# Altium schematic sheet PMIC.SchDoc
size A2; SheetNumber: 5; SheetTotal: 6
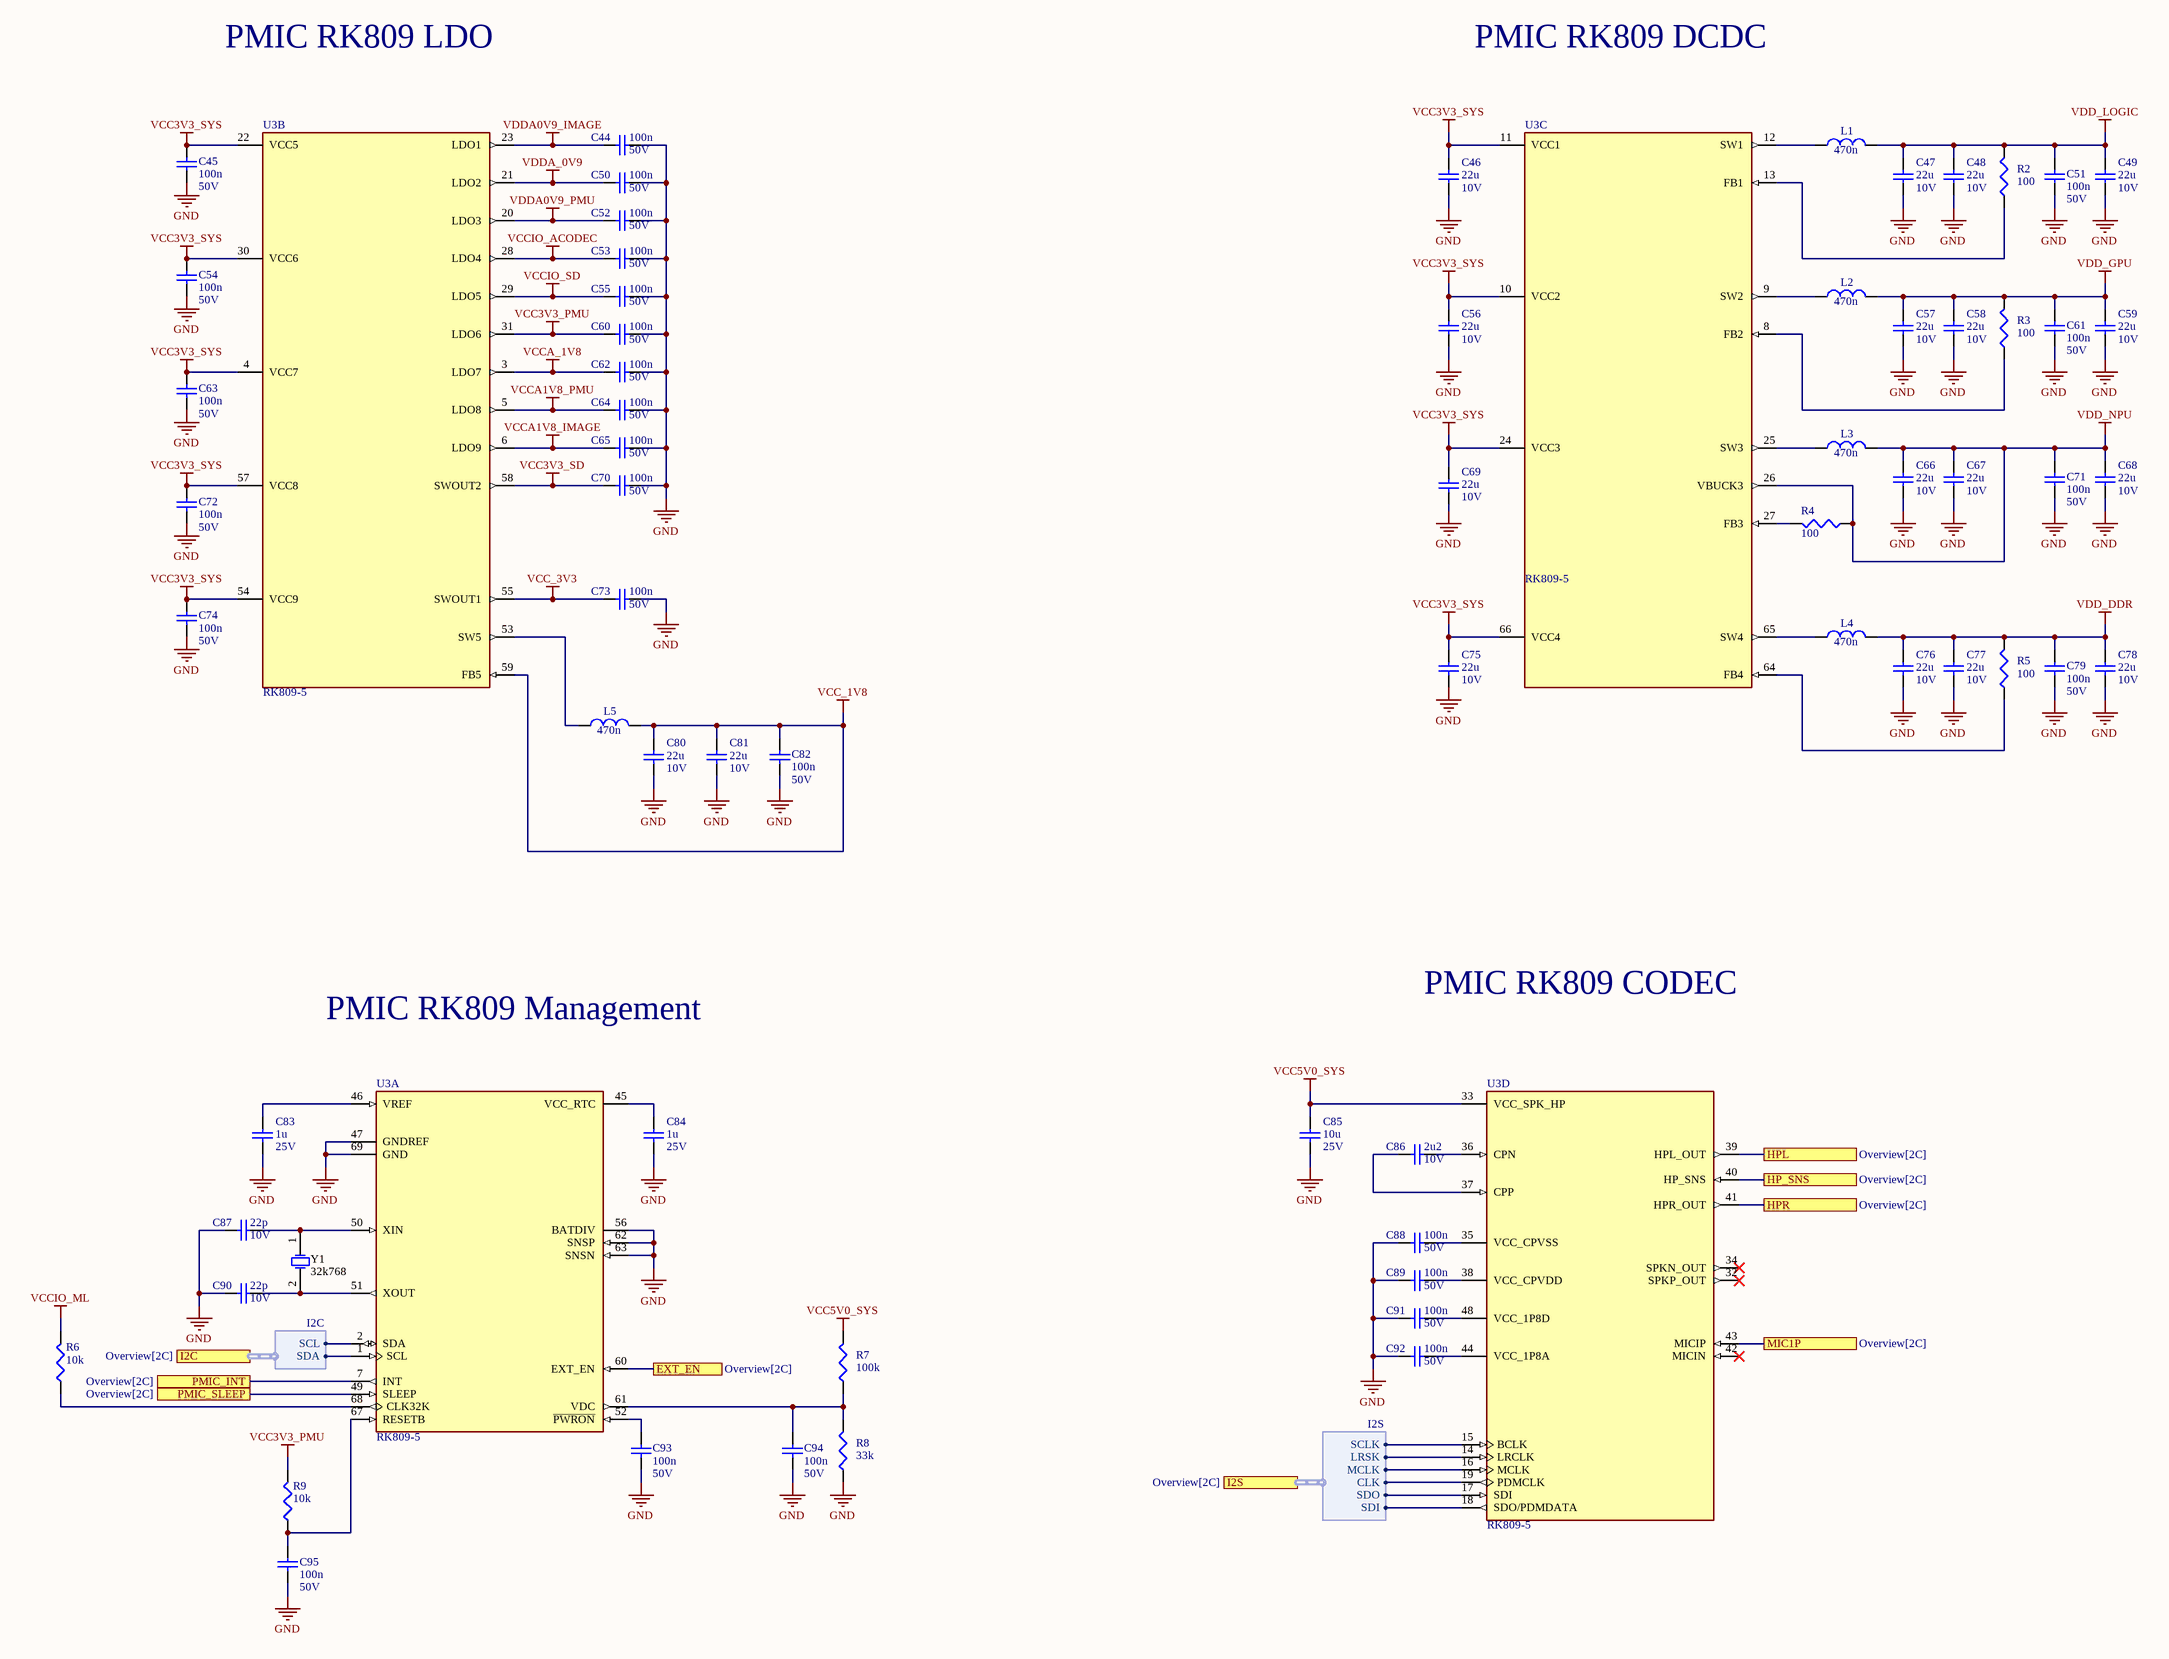
[diagram p0: PMIC.SchDoc]

## Parts
C44  value 100n  Voltage: 50V  [GRM155R71H104KE14D]  (hidden comment: GRM155R71H104KE14D)
C45  value 100n  Voltage: 50V  [GRM155R71H104KE14D]  (hidden comment: GRM155R71H104KE14D)
C46  value 22u  Voltage: 10V  [GRM188R61A226ME15D]  (hidden comment: GRM188R61A226ME15D)
C47  value 22u  Voltage: 10V  [GRM188R61A226ME15D]  (hidden comment: GRM188R61A226ME15D)
C48  value 22u  Voltage: 10V  [GRM188R61A226ME15D]  (hidden comment: GRM188R61A226ME15D)
C49  value 22u  Voltage: 10V  [GRM188R61A226ME15D]  (hidden comment: GRM188R61A226ME15D)
C50  value 100n  Voltage: 50V  [GRM155R71H104KE14D]  (hidden comment: GRM155R71H104KE14D)
C51  value 100n  Voltage: 50V  [GRM155R71H104KE14D]  (hidden comment: GRM155R71H104KE14D)
C52  value 100n  Voltage: 50V  [GRM155R71H104KE14D]  (hidden comment: GRM155R71H104KE14D)
C53  value 100n  Voltage: 50V  [GRM155R71H104KE14D]  (hidden comment: GRM155R71H104KE14D)
C54  value 100n  Voltage: 50V  [GRM155R71H104KE14D]  (hidden comment: GRM155R71H104KE14D)
C55  value 100n  Voltage: 50V  [GRM155R71H104KE14D]  (hidden comment: GRM155R71H104KE14D)
C56  value 22u  Voltage: 10V  [GRM188R61A226ME15D]  (hidden comment: GRM188R61A226ME15D)
C57  value 22u  Voltage: 10V  [GRM188R61A226ME15D]  (hidden comment: GRM188R61A226ME15D)
C58  value 22u  Voltage: 10V  [GRM188R61A226ME15D]  (hidden comment: GRM188R61A226ME15D)
C59  value 22u  Voltage: 10V  [GRM188R61A226ME15D]  (hidden comment: GRM188R61A226ME15D)
C60  value 100n  Voltage: 50V  [GRM155R71H104KE14D]  (hidden comment: GRM155R71H104KE14D)
C61  value 100n  Voltage: 50V  [GRM155R71H104KE14D]  (hidden comment: GRM155R71H104KE14D)
C62  value 100n  Voltage: 50V  [GRM155R71H104KE14D]  (hidden comment: GRM155R71H104KE14D)
C63  value 100n  Voltage: 50V  [GRM155R71H104KE14D]  (hidden comment: GRM155R71H104KE14D)
C64  value 100n  Voltage: 50V  [GRM155R71H104KE14D]  (hidden comment: GRM155R71H104KE14D)
C65  value 100n  Voltage: 50V  [GRM155R71H104KE14D]  (hidden comment: GRM155R71H104KE14D)
C66  value 22u  Voltage: 10V  [GRM188R61A226ME15D]  (hidden comment: GRM188R61A226ME15D)
C67  value 22u  Voltage: 10V  [GRM188R61A226ME15D]  (hidden comment: GRM188R61A226ME15D)
C68  value 22u  Voltage: 10V  [GRM188R61A226ME15D]  (hidden comment: GRM188R61A226ME15D)
C69  value 22u  Voltage: 10V  [GRM188R61A226ME15D]  (hidden comment: GRM188R61A226ME15D)
C70  value 100n  Voltage: 50V  [GRM155R71H104KE14D]  (hidden comment: GRM155R71H104KE14D)
C71  value 100n  Voltage: 50V  [GRM155R71H104KE14D]  (hidden comment: GRM155R71H104KE14D)
C72  value 100n  Voltage: 50V  [GRM155R71H104KE14D]  (hidden comment: GRM155R71H104KE14D)
C73  value 100n  Voltage: 50V  [GRM155R71H104KE14D]  (hidden comment: GRM155R71H104KE14D)
C74  value 100n  Voltage: 50V  [GRM155R71H104KE14D]  (hidden comment: GRM155R71H104KE14D)
C75  value 22u  Voltage: 10V  [GRM188R61A226ME15D]  (hidden comment: GRM188R61A226ME15D)
C76  value 22u  Voltage: 10V  [GRM188R61A226ME15D]  (hidden comment: GRM188R61A226ME15D)
C77  value 22u  Voltage: 10V  [GRM188R61A226ME15D]  (hidden comment: GRM188R61A226ME15D)
C78  value 22u  Voltage: 10V  [GRM188R61A226ME15D]  (hidden comment: GRM188R61A226ME15D)
C79  value 100n  Voltage: 50V  [GRM155R71H104KE14D]  (hidden comment: GRM155R71H104KE14D)
C80  value 22u  Voltage: 10V  [GRM188R61A226ME15D]  (hidden comment: GRM188R61A226ME15D)
C81  value 22u  Voltage: 10V  [GRM188R61A226ME15D]  (hidden comment: GRM188R61A226ME15D)
C82  value 100n  Voltage: 50V  [GRM155R71H104KE14D]  (hidden comment: GRM155R71H104KE14D)
C83  value 1u  Voltage: 25V  [GRM155R61E105KA12D]  (hidden comment: GRM155R61E105KA12D)
C84  value 1u  Voltage: 25V  [GRM155R61E105KA12D]  (hidden comment: GRM155R61E105KA12D)
C85  value 10u  Voltage: 25V  (hidden comment: GRM188R61E106MA73D)
C86  value 2u2  Voltage: 10V  [GRM155R60J475ME47D]  (hidden comment: Capacitor 2u2)
C87  value 22p  Voltage: 10V  [GRM155R60J475ME47D]  (hidden comment: CAP 22P)
C88  value 100n  Voltage: 50V  [GRM155R71H104KE14D]  (hidden comment: GRM155R71H104KE14D)
C89  value 100n  Voltage: 50V  [GRM155R71H104KE14D]  (hidden comment: GRM155R71H104KE14D)
C90  value 22p  Voltage: 10V  [GRM155R60J475ME47D]  (hidden comment: CAP 22P)
C91  value 100n  Voltage: 50V  [GRM155R71H104KE14D]  (hidden comment: GRM155R71H104KE14D)
C92  value 100n  Voltage: 50V  [GRM155R71H104KE14D]  (hidden comment: GRM155R71H104KE14D)
C93  value 100n  Voltage: 50V  [GRM155R71H104KE14D]  (hidden comment: GRM155R71H104KE14D)
C94  value 100n  Voltage: 50V  [GRM155R71H104KE14D]  (hidden comment: GRM155R71H104KE14D)
C95  value 100n  Voltage: 50V  [GRM155R71H104KE14D]  (hidden comment: GRM155R71H104KE14D)
L1  value 470n  (hidden comment: MCS20FC-R47MHC)
L2  value 470n  (hidden comment: MCS20FC-R47MHC)
L3  value 470n  (hidden comment: MCS20FC-R47MHC)
L4  value 470n  (hidden comment: MCS20FC-R47MHC)
L5  value 470n  (hidden comment: MCS20FC-R47MHC)
R2  value 100  [RC0402FR-07100RL]  (hidden comment: RC0402FR-07100RL)
R3  value 100  [RC0402FR-07100RL]  (hidden comment: RC0402FR-07100RL)
R4  value 100  [RC0402FR-07100RL]  (hidden comment: RC0402FR-07100RL)
R5  value 100  [RC0402FR-07100RL]  (hidden comment: RC0402FR-07100RL)
R6  value 10k  [RC0402FR-0718KL]  (hidden comment: RES 10k)
R7  value 100k  [RC0402FR-07100KL]  (hidden comment: RC0402FR-07100KL)
R8  value 33k  [RC0402FR-07100KL]  (hidden comment: RES 33k)
R9  value 10k  [RC0402FR-0718KL]  (hidden comment: RES 10k)
U3  RK809-5  [RK809-5]  (parts A,B,C,D of 4)
Y1  32k768

## Ports
EXT_EN (see Overview[2C]), HP_SNS (see Overview[2C]), HPL (see Overview[2C]), HPR (see Overview[2C]), I2C (harness I2C, see Overview[2C]), I2S (harness I2S, see Overview[2C]), MIC1P (see Overview[2C]), PMIC_INT (see Overview[2C]), PMIC_SLEEP (see Overview[2C])

## Harnesses
I2C: SCL, SDA
I2S: SCLK, LRSK, MCLK, CLK, SDI, SDO

## Nets
GND: C44.2 C45.1 C46.2 C47.2 C48.2 C49.2 C50.2 C51.2 C52.2 C53.2 C54.1 C55.2 C56.2 C57.2 C58.2 C59.2 C60.2 C61.2 C62.2 C63.1 C64.2 C65.2 C66.2 C67.2 C68.2 C69.2 C70.2 C71.2 C72.1 C73.2 C74.1 C75.2 C76.2 C77.2 C78.2 C79.2 C80.2 C81.2 C82.2 C83.2 C84.2 C85.2 C87.1 C88.1 C89.1 C90.1 C91.1 C92.1 C93.2 C94.2 C95.2 R8.2 U3.47(GNDREF) U3.56(BATDIV) U3.62(SNSP) U3.63(SNSN) U3.69(GND)
VCC3V3_PMU: C60.1 R9.1 U3.31(LDO6)
VCC3V3_SD: C70.1 U3.58(SWOUT2)
VCC3V3_SYS: C45.2 C46.1 C54.2 C56.1 C63.2 C69.1 C72.2 C74.2 C75.1 U3.4(VCC7) U3.10(VCC2) U3.11(VCC1) U3.22(VCC5) U3.24(VCC3) U3.30(VCC6) U3.54(VCC9) U3.57(VCC8) U3.66(VCC4)
VCC5V0_SYS: C85.1 R7.1 U3.33(VCC_SPK_HP)
VCC_1V8: C80.1 C81.1 C82.1 L5.2 U3.59(FB5)
VCC_3V3: C73.1 U3.55(SWOUT1)
VCCA1V8_IMAGE: C65.1 U3.6(LDO9)
VCCA1V8_PMU: C64.1 U3.5(LDO8)
VCCA_1V8: C62.1 U3.3(LDO7)
VCCIO_ACODEC: C53.1 U3.28(LDO4)
VCCIO_ML: R6.1
VCCIO_SD: C55.1 U3.29(LDO5)
VDD_DDR: C76.1 C77.1 C78.1 C79.1 L4.2 R5.1
VDD_GPU: C57.1 C58.1 C59.1 C61.1 L2.2 R3.1
VDD_LOGIC: C47.1 C48.1 C49.1 C51.1 L1.2 R2.1
VDD_NPU: C66.1 C67.1 C68.1 C71.1 L3.2 R4.2 U3.26(VBUCK3)
VDDA0V9_IMAGE: C44.1 U3.23(LDO1)
VDDA0V9_PMU: C52.1 U3.20(LDO3)
VDDA_0V9: C50.1 U3.21(LDO2)
EXT_EN: U3.60(EXT_EN) ; port EXT_EN
HP_SNS: U3.40(HP_SNS) ; port HP_SNS
HPL: U3.39(HPL_OUT) ; port HPL
HPR: U3.41(HPR_OUT) ; port HPR
MIC1P: U3.43(MICIP) ; port MIC1P
PMIC_INT: U3.7(INT) ; port PMIC_INT
PMIC_SLEEP: U3.49(SLEEP) ; port PMIC_SLEEP
NetC83_1: C83.1 U3.46(VREF)
NetC84_1: C84.1 U3.45(VCC_RTC)
NetC86_1: C86.1 U3.37(CPP)
NetC86_2: C86.2 U3.36(CPN)
NetC87_2: C87.2 U3.50(XIN) Y1.1
NetC88_2: C88.2 U3.35(VCC_CPVSS)
NetC89_2: C89.2 U3.38(VCC_CPVDD)
NetC90_2: C90.2 U3.51(XOUT) Y1.2
NetC91_2: C91.2 U3.48(VCC_1P8D)
NetC92_2: C92.2 U3.44(VCC_1P8A)
NetC93_1: C93.1 U3.52(~{PWRON})
NetC94_1: C94.1 R7.2 R8.1 U3.61(VDC)
NetC95_1: C95.1 R9.2 U3.67(RESETB)
NetL1_1: L1.1 U3.12(SW1)
NetL2_1: L2.1 U3.9(SW2)
NetL3_1: L3.1 U3.25(SW3)
NetL4_1: L4.1 U3.65(SW4)
NetL5_1: L5.1 U3.53(SW5)
NetR2_2: R2.2 U3.13(FB1)
NetR3_2: R3.2 U3.8(FB2)
NetR4_1: R4.1 U3.27(FB3)
NetR5_2: R5.2 U3.64(FB4)
NetR6_2: R6.2 U3.68(CLK32K)
NetU3_1: U3.1(SCL) ; port I2C.SDA
NetU3_2: U3.2(SDA) ; port I2C.SCL
NetU3_14: U3.14(LRCLK) ; port I2S.LRSK
NetU3_15: U3.15(BCLK) ; port I2S.SCLK
NetU3_16: U3.16(MCLK) ; port I2S.MCLK
NetU3_17: U3.17(SDI) ; port I2S.SDO
NetU3_18: U3.18(SDO/PDMDATA) ; port I2S.SDI
NetU3_19: U3.19(PDMCLK) ; port I2S.CLK

Not connected (* = marked no-connect by the designer): U3 32(SPKP_OUT)* 34(SPKN_OUT)* 42(MICIN)*

## Notes on the sheet
- PMIC RK809 LDO
- PMIC RK809 DCDC
- PMIC RK809 CODEC
- PMIC RK809 Management

## Library data of the parts
C44 C45 C50-C55 C60-C65 C70-C74 C79 C82 C88 C89 C91-C95 = GRM155R71H104KE14D: CAP 100N 50V X7R 0402; Size: 0402; Dielectric: X7R; Manufacturer Part Number 1: GRM155R71H104KE14D
C46-C49 C56-C59 C66-C69 C75-C78 C80 C81 = GRM188R61A226ME15D: CAP 22U 10V X5R 0603; Size: 0603; Dielectric: X5R; Manufacturer Part Number 1: GRM188R61A226ME15D
C83 C84 = GRM155R61E105KA12D: CAP 1U 25V X5R 0402; Size: 0402; Dielectric: X5R; Manufacturer Part Number 1: GRM155R61E105KA12D
C85 = GRM188R61E106MA73D: CAP 10U 25V X5R 0603; Size: 0603; Dielectric: X5R
C86 = Capacitor 2u2: CAP 2.2U 6.3V X5R 0402; Size: 0402; Dielectric: X5R; Manufacturer Part Number 1: GRM155R60J475ME47D
C87 C90 = CAP 22P: CAP 22P 6.3V X5R 0402; Size: 0402; Dielectric: X5R; Manufacturer Part Number 1: GRM155R60J475ME47D
L1-L5 = MCS20FC-R47MHC: IND 470N 4.05A 0806
R2-R5 = RC0402FR-07100RL: RES 100 1% 0402; Size: 0603; Manufacturer Part Number 1: RC0402FR-07100RL
R6 R9 = RES 10k: RES 10k 1% 62.5mW 0402; Size: 0402; Manufacturer Part Number 1: RC0402FR-0718KL
R7 = RC0402FR-07100KL: RES 100k 1% 62.5mW 0402; Size: 0603; Manufacturer Part Number 1: RC0402FR-07100KL
R8 = RES 33k: RES 33k 1% 62.5mW 0402; Size: 0603; Manufacturer Part Number 1: RC0402FR-07100KL
U3 = RK809-5: Complex power-management integrated circuit (PMIC) integratedCODEC for multi-core system applications; MF: Fuzhou Rockchip Electronics Co; MP: RK809-1; SnapEDA_Link: https://www.snapeda.com/parts/RK809-1/Fuzhou+Rockchip+Electronics+Co/view-part/?ref=snap; Package: Package; Value: *; Check_prices: https://www.snapeda.com/parts/RK809-1/Fuzhou+Rockchip+Electronics+Co/view-part/?ref=eda
Y1 = 32.768 Crystal